# Altium schematic sheet Main.SchDoc
size A4; SheetNumber: 1; SheetTotal: 1
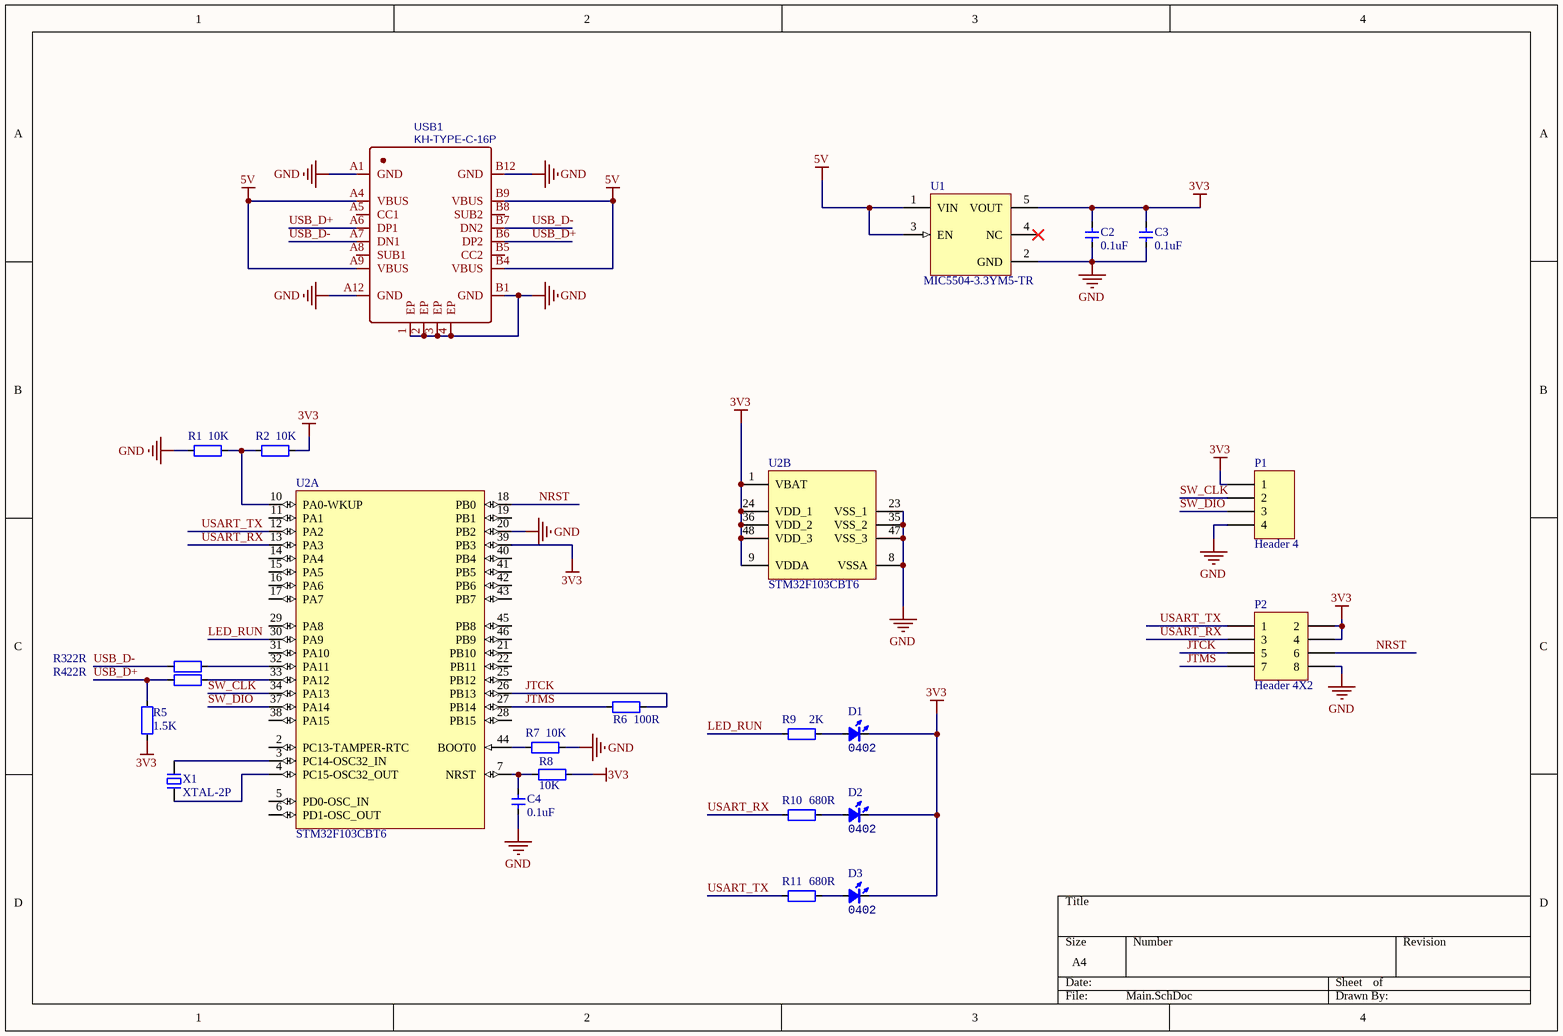
[diagram p0: Main.SchDoc]

## Parts
C2  0.1uF  [CAP_0402]
C3  0.1uF  [CAP_0402]
C4  0.1uF  [CAP_0402]
D1  Type: 0402  [LED_0402_BLUE]  (hidden comment: color?)
D2  Type: 0402  [LED_0402_BLUE]  (hidden comment: color?)
D3  Type: 0402  [LED_0402_BLUE]  (hidden comment: color?)
P1  Header 4  [TP-2.54-4P]
P2  Header 4X2  [HDR2X4_2.54_180H]
R1  10K  [RES_0402]
R2  10K  [RES_0402]
R3  22R  [RES_0402]
R4  22R  [RES_0402]
R5  1.5K  [RES_0402]
R6  100R  [RES_0402]
R7  10K  [RES_0402]
R8  10K  [RES_0402]
R9  2K  [RES_0402]
R10  680R  [RES_0402]
R11  680R  [RES_0402]
U1  MIC5504-3.3YM5-TR  [MCHP-SOT-23-M5_V]
U2  STM32F103CBT6  [LQFP-48]  (parts A,B of 2)
USB1  KH-TYPE-C-16P  [Type-C-SMD-16P-TOP]
X1  XTAL-2P  [OSC 5032-2P]

## Nets
3V3: C2.2 C3.2 D1.2(K) D2.2(K) D3.2(K) P1.1 P2.2 P2.4 R2.2 R5.1 R8.2 U1.5(VOUT) U2.1(VBAT) U2.9(VDDA) U2.24(VDD_1) U2.36(VDD_2) U2.39(PB3) U2.48(VDD_3)
5V: U1.1(VIN) U1.3(EN) USB1.A4(VBUS) USB1.A9(VBUS) USB1.B4(VBUS) USB1.B9(VBUS)
GND: C2.1 C3.1 C4.1 P1.4 P2.8 R1.1 R7.2 U1.2(GND) U2.8(VSSA) U2.20(PB2) U2.23(VSS_1) U2.35(VSS_2) U2.47(VSS_3) USB1.1(EP) USB1.2(EP) USB1.3(EP) USB1.4(EP) USB1.A1(GND) USB1.A12(GND) USB1.B1(GND) USB1.B12(GND)
JTCK: P2.5 R6.2 U2.26(PB13)
JTMS: P2.7 R6.1 U2.27(PB14)
LED_RUN: R9.1 U2.30(PA9)
NRST: P2.6 U2.18(PB0)
SW_CLK: P1.2 U2.34(PA13)
SW_DIO: P1.3 U2.37(PA14)
USART_RX: P2.3 R10.1 U2.13(PA3)
USART_TX: P2.1 R11.1 U2.12(PA2)
USB_D+: R4.1 R5.2 USB1.A6(DP1) USB1.B6(DP2)
USB_D-: R3.1 USB1.A7(DN1) USB1.B7(DN2)
NetC4_2: C4.2 R8.1 U2.7(NRST)
NetD1_1: D1.1(A) R9.2
NetD2_1: D2.1(A) R10.2
NetD3_1: D3.1(A) R11.2
NetR1_2: R1.2 R2.1 U2.10(PA0-WKUP)
NetR3_2: R3.2 U2.32(PA11)
NetR4_2: R4.2 U2.33(PA12)
NetR7_1: R7.1 U2.44(BOOT0)
NetU2_3: U2.3(PC14-OSC32_IN) X1.2
NetU2_4: U2.4(PC15-OSC32_OUT) X1.1

Not connected (* = marked no-connect by the designer): U1 4(NC)*; U2 2(PC13-TAMPER-RTC) 5(PD0-OSC_IN) 6(PD1-OSC_OUT) 11(PA1) 14(PA4) 15(PA5) 16(PA6) 17(PA7) 19(PB1) 21(PB10) 22(PB11) 25(PB12) 28(PB15) 29(PA8) 31(PA10) 38(PA15) 40(PB4) 41(PB5) 42(PB6) 43(PB7) 45(PB8) 46(PB9); USB1 A5(CC1) A8(SUB1) B5(CC2) B8(SUB2)

## Library data of the parts
C2-C4 = 电容-0402: Capacitor; Value: 0.1u
D1-D3 = LED_0402: LED; Value: color?
P1 = Header 4: Header, 4-Pin; LatestRevisionDate: 17-Jul-2002; LatestRevisionNote: Re-released for DXP Platform.; Publisher: Altium Limited
P2 = Header 4X2: Header, 4-Pin, Dual row; LatestRevisionDate: 17-Jul-2002; LatestRevisionNote: Re-released for DXP Platform.; Publisher: Altium Limited
R1 R2 R5-R11 = 电阻-0402: Resistor; Value: 22R
R3 R4 = 电阻-0402: Resistor; Value: 22R
U1 = CMP-2000-07604-1: Single LDO, 2.5 to 5.5 V, Fixed Out 3.3 V, 0.3 A, -40 to 125 degC, 5-Pin SOT-23 (M5), RoHS, Tape and Reel; Manufacturer: Microchip; Number of Regulators: 1; Dropout Voltage: 160mV; Output Current: 300mA; Min Input Voltage: 2.5V; Nominal Output Voltage: 3.3V; Max Input Voltage: 5.5V; Min Current Limit: 400mA; Number of Pins: 5; RoHSCompliant: True; Min Operating Temperature: -40degC; Case\/Package: SOT-23; Datasheet URL: http://ww1.microchip.com/downloads/en/DeviceDoc/MIC550X.pdf; Package Description: 5-Pin Small Outline Transistor, Body 1.6 x 2.9 mm, Pitch 0.95 mm; Max Operating Temperature: 125degC; Packaging: CutTape; Manufacturer URL: http://www.microchip.com/; Package Reference: SOT-23; Mount: SurfaceMount; Output Voltage: 3.3V; Mounting Technology: SurfaceMount; Lead Free: LeadFree; REACH SVHC: NoSVHC; Datasheet Version: Rev. 2.3, 04/2015
U2 = CMP-0237-00250-3: ARM Cortex-M3 32-bit MCU, 128 KB Flash, 20 KB Internal RAM, 37 I/Os, 48-pin LQFP, -40 to 85 degC, Tray; Supply Voltage(Vcc) min (V): 2; Operating Frequency(F) (Processor speed) (MHz): 72; A/D Converter: 2x12-bit (10 Channel); FLASH Size (Prog) (kB): 128; Internal RAM Size (kB): 20; I/Os (High Current): 37; ComponentLink2Description: Datasheet; PackageReference: LQFP48; PartNumber: STM32F103CBT6; ComponentLink1Description: Manufacturer URL; DatasheetVersion: Rev. 16; PackageVersion: Rev. 6, 06/2013; Packing: Tray; ComponentLink1URL: http://www.st.com/web/en/home.html; Mounting Technology: Surface Mount; ComponentLink3URL: http://www.st.com/st-web-ui/static/active/en/resource/technical/document/datasheet/DM00058181.pdf; PackageDescription: 48-Pin Low Profile Quad Flat Package, 7 x 7 mm Body, 0.5 mm Pitch; Core: ARM Cortex-M3; ComponentLink3Description: Package Specification; ComponentLink2URL: http://www.st.com/st-web-ui/static/active/en/resource/technical/document/datasheet/CD00161566.pdf
USB1 = KH-TYPE-C-16P: BOM_Manufacturer: Shenzhen Kinghelm Elec; Contributor: LCSC; BOM_Supplier: LCSC; BOM_Supplier Part: C709357; BOM_Manufacturer Part: KH-TYPE-C-16P; BOM_JLCPCB Part Class: Extended Part; spicePre: U; spiceSymbolName: KH-TYPE-C-16P
X1 = XTAL-2P: 2脚无源脚晶振